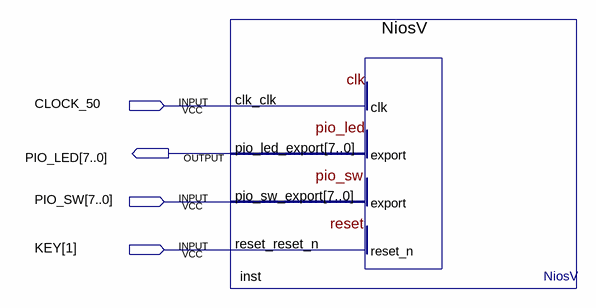
[diagram p0: schematic sheet]
// Quartus schematic Niosv.bdf as structural Verilog: 1 symbols, 4 pins
module Niosv (
  input  CLOCK_50,
  input  [7:0] PIO_SW,
  input  [1:1] KEY,
  output [7:0] PIO_LED
);

  NiosV inst (.clk_clk(CLOCK_50), .pio_sw_export(PIO_SW), .reset_reset_n(KEY[1]), .pio_led_export(PIO_LED));
endmodule
